# Altium schematic sheet top_level.SchDoc
size A4
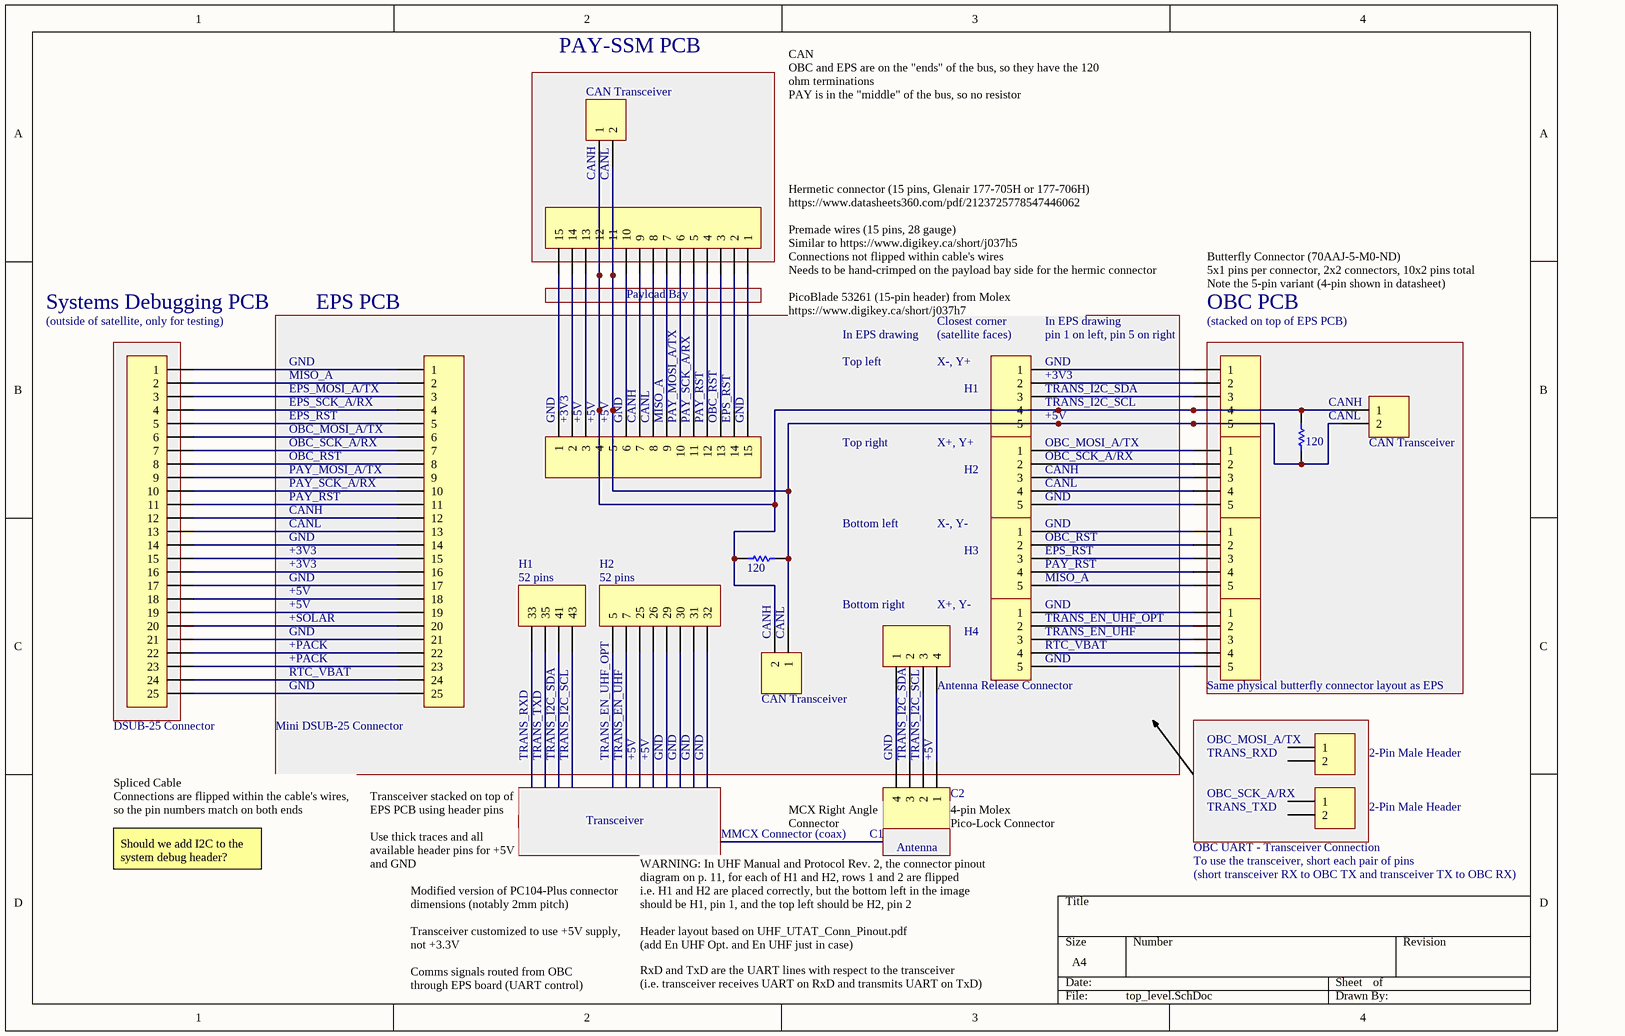
[diagram p0: top_level.SchDoc]

## Parts
(Parts that share a designator on the sheet are numbered #1, #2 ... from top to bottom, then left to right.)
C2  Antenna Release Connector  [HDR1X4]  (value not drawn)
P?#1  CAN Transceiver  [HDR1X2]
P?#2  Header 15  [HDR1X15]  (value not drawn)
P?#3  Header 25  [HDR1X25]  (value not drawn)
P?#4  Header 25  [HDR1X25]  (value not drawn)
P?#5  Header 5  [HDR1X5]  (value not drawn)
P?#6  Header 5  [HDR1X5]  (value not drawn)
P?#7  CAN Transceiver  [HDR1X2]
P?#8  Header 15  [HDR1X15]  (value not drawn)
P?#9  Header 5  [HDR1X5]  (value not drawn)
P?#10  Header 5  [HDR1X5]  (value not drawn)
P?#11  Header 5  [HDR1X5]  (value not drawn)
P?#12  Header 5  [HDR1X5]  (value not drawn)
P?#13  Header 5  [HDR1X5]  (value not drawn)
P?#14  Header 5  [HDR1X5]  (value not drawn)
P?#15  Header 4  [HDR1X4]  (value not drawn)
P?#16  Header 8  [HDR1X8]  (value not drawn)
P?#17  CAN Transceiver  [HDR1X2]
P?#18  Antenna Release Connector  [HDR1X4]  (value not drawn)
P?#19  Header 2  [HDR1X2]  (value not drawn)
P?#20  Header 2  [HDR1X2]  (value not drawn)
R?#1  value 120  [AXIAL-0.3]  (hidden comment: Res1)
R?#2  value 120  [AXIAL-0.3]  (hidden comment: Res1)

## Blocks framed on the sheet
PAY-SSM PCB: P?#1 P?#2
EPS PCB: P?#4 P?#5 P?#8 P?#9 P?#11 P?#13 P?#15-P?#18 R?#2

## Nets
NetC2_1: C2.1 P?#18.4
NetC2_2: C2.2 P?#18.3
NetC2_3: C2.3 P?#18.2
NetC2_4: C2.4 P?#18.1
NetP?#1_1: P?#1.1 P?#2.12 P?#5.4 P?#6.4 P?#7.1 P?#8.4 P?#17.2 R?#1.2 R?#2.2
NetP?#1_2: P?#1.2 P?#2.11 P?#5.5 P?#6.5 P?#7.2 P?#8.5 P?#17.1 R?#1.1 R?#2.1
NetP?#2_1: P?#2.1 P?#8.15
NetP?#2_2: P?#2.2 P?#8.14
NetP?#2_3: P?#2.3 P?#8.13
NetP?#2_4: P?#2.4 P?#8.12
NetP?#2_5: P?#2.5 P?#8.11
NetP?#2_6: P?#2.6 P?#8.10
NetP?#2_7: P?#2.7 P?#8.9
NetP?#2_8: P?#2.8 P?#8.8
NetP?#2_9: P?#2.9 P?#8.7
NetP?#2_10: P?#2.10 P?#8.6
NetP?#2_13: P?#2.13 P?#8.3
NetP?#2_14: P?#2.14 P?#8.2
NetP?#2_15: P?#2.15 P?#8.1
NetP?#3_1: P?#3.1 P?#4.1
NetP?#3_2: P?#3.2 P?#4.2
NetP?#3_3: P?#3.3 P?#4.3
NetP?#3_4: P?#3.4 P?#4.4
NetP?#3_5: P?#3.5 P?#4.5
NetP?#3_6: P?#3.6 P?#4.6
NetP?#3_7: P?#3.7 P?#4.7
NetP?#3_8: P?#3.8 P?#4.8
NetP?#3_9: P?#3.9 P?#4.9
NetP?#3_10: P?#3.10 P?#4.10
NetP?#3_11: P?#3.11 P?#4.11
NetP?#3_12: P?#3.12 P?#4.12
NetP?#3_13: P?#3.13 P?#4.13
NetP?#3_14: P?#3.14 P?#4.14
NetP?#3_15: P?#3.15 P?#4.15
NetP?#3_16: P?#3.16 P?#4.16
NetP?#3_17: P?#3.17 P?#4.17
NetP?#3_18: P?#3.18 P?#4.18
NetP?#3_19: P?#3.19 P?#4.19
NetP?#3_20: P?#3.20 P?#4.20
NetP?#3_21: P?#3.21 P?#4.21
NetP?#3_22: P?#3.22 P?#4.22
NetP?#3_23: P?#3.23 P?#4.23
NetP?#3_24: P?#3.24 P?#4.24
NetP?#3_25: P?#3.25 P?#4.25
NetP?#5_1: P?#5.1 P?#6.1
NetP?#5_2: P?#5.2 P?#6.2
NetP?#5_3: P?#5.3 P?#6.3
NetP?#9_1: P?#9.1 P?#10.1
NetP?#9_2: P?#9.2 P?#10.2
NetP?#9_3: P?#9.3 P?#10.3
NetP?#9_4: P?#9.4 P?#10.4
NetP?#9_5: P?#9.5 P?#10.5
NetP?#11_1: P?#11.1 P?#12.1
NetP?#11_2: P?#11.2 P?#12.2
NetP?#11_3: P?#11.3 P?#12.3
NetP?#11_4: P?#11.4 P?#12.4
NetP?#11_5: P?#11.5 P?#12.5
NetP?#13_1: P?#13.1 P?#14.1
NetP?#13_2: P?#13.2 P?#14.2
NetP?#13_3: P?#13.3 P?#14.3
NetP?#13_4: P?#13.4 P?#14.4
NetP?#13_5: P?#13.5 P?#14.5

Not connected (* = marked no-connect by the designer): P?#15 1(33) 2(35) 3(41) 4(43); P?#16 1(5) 2(7) 3(25) 4(26) 5(29) 6(30) 7(31) 8(32); P?#19 1 2; P?#20 1 2

## Notes on the sheet
- CAN
  OBC and EPS are on the "ends" of the bus, so they have the 120 ohm terminations
  PAY is in the "middle" of the bus, so no resistor
- (near P?#1) CANH
- (near P?#1) CANL
- Hermetic connector (15 pins, Glenair 177-705H or 177-706H)
  https://www.datasheets360.com/pdf/2123725778547446062
- Systems Debugging PCB
- (near P?#2) Payload Bay
- PicoBlade 53261 (15-pin header) from Molex
  https://www.digikey.ca/short/j037h7
- (near P?#2) Premade wires (15 pins, 28 gauge)
  Similar to https://www.digikey.ca/short/j037h5
  Connections not flipped within cable's wires
  Needs to be hand-crimped on the payload bay side for the hermic connector
- OBC PCB
- Butterfly Connector (70AAJ-5-M0-ND)
  5x1 pins per connector, 2x2 connectors, 10x2 pins total
  Note the 5-pin variant (4-pin shown in datasheet)
- (near P?#3) (outside of satellite, only for testing)
- GND
- MISO_A
- In EPS drawing
- Top left
- X-, Y+
- (near P?#5) Closest corner
- (near P?#5) (satellite faces)
- (near P?#5) +3V3
- (near P?#5) GND
- (near P?#5) In EPS drawing
- (near P?#6) pin 1 on left, pin 5 on right
- (near P?#6) (stacked on top of EPS PCB)
- EPS_MOSI_A/TX
- EPS_SCK_A/RX
- EPS_RST
- OBC_MOSI_A/TX
- OBC_SCK_A/RX
- (near P?#8) GND
- (near P?#8) +3V3
- (near P?#8) +5V
- (near P?#8) CANH
- (near P?#8) CANL
- (near P?#8) MISO_A
- (near P?#8) PAY_MOSI_A/TX
- (near P?#8) PAY_SCK_A/RX
- (near P?#8) PAY_RST
- (near P?#8) OBC_RST
- (near P?#8) EPS_RST
- Top right
- X+, Y+
- H1
- (near P?#9) OBC_MOSI_A/TX
- (near P?#5) +5V
- (near P?#5) TRANS_I2C_SDA
- (near P?#5) TRANS_I2C_SCL
- (near P?#7) CANH
- CANL
- OBC_RST
- PAY_MOSI_A/TX
- PAY_SCK_A/RX
- PAY_RST
- CANH
- H2
- (near P?#9) CANH
- (near P?#9) CANL
- (near P?#9) OBC_SCK_A/RX
- (near P?#9) GND
- +3V3
- (near P?#15) 52 pins
- (near P?#16) 52 pins
- Bottom left
- X-, Y-
- H3
- (near P?#11) EPS_RST
- (near P?#11) PAY_RST
- (near P?#11) OBC_RST
- (near P?#11) MISO_A
- (near P?#11) GND
- +PACK
- +5V
- +SOLAR
- (near P?#17) CANH
- (near P?#17) CANL
- Bottom right
- X+, Y-
- (near P?#18) H4
- (near P?#13) TRANS_EN_UHF_OPT
- (near P?#13) TRANS_EN_UHF
- (near P?#13) RTC_VBAT
- (near P?#13) GND
- RTC_VBAT
- (near P?#13) Antenna Release Connector
- (near P?#14) Same physical butterfly connector layout as EPS
- (near P?#3) DSUB-25 Connector
- (near P?#4) Mini DSUB-25 Connector
- TRANS_RXD
- TRANS_TXD
- TRANS_I2C_SDA
- TRANS_I2C_SCL
- (near P?#16) TRANS_EN_UHF_OPT
- TRANS_EN_UHF
- (near C2) GND
- (near C2) +5V
- (near P?#19) TRANS_RXD
- (near P?#19) OBC_MOSI_A/TX
- 2-Pin Male Header
- Spliced Cable
  Connections are flipped within the cable's wires,
  so the pin numbers match on both ends
- Transceiver stacked on top of EPS PCB using header pins
- Transceiver
- MMCX Connector (coax)
- (near C2) MCX Right Angle Connector
- (near C2) C1
- Antenna
- (near C2) 4-pin Molex Pico-Lock Connector
- (near P?#20) OBC UART - Transceiver Connection
- (near P?#20) TRANS_TXD
- (near P?#20) OBC_SCK_A/RX
- Should we add I2C to the system debug header?
- Use thick traces and all available header pins for +5V and GND
- Modified version of PC104-Plus connector dimensions (notably 2mm pitch)
- WARNING: In UHF Manual and Protocol Rev. 2, the connector pinout diagram on p. 11, for each of H1 and H2, rows 1 and 2 are flipped
  i.e. H1 and H2 are placed correctly, but the bottom left in the image should be H1, pin 1, and the top left should be H2, pin 2
- (near P?#20) To use the transceiver, short each pair of pins
- (short transceiver RX to OBC TX and transceiver TX to OBC RX)
- Comms signals routed from OBC through EPS board (UART control)
- Transceiver customized to use +5V supply, not +3.3V
  To get 2W of power
  (add En UHF Opt. and En UHF just in case)
- Header layout based on UHF_UTAT_Conn_Pinout.pdf
  (add En UHF Opt. and En UHF just in case)
- RxD and TxD are the UART lines with respect to the transceiver
  (i.e. transceiver receives UART on RxD and transmits UART on TxD)

## Library data of the parts
C2 P?#15 P?#18 = Header 4: Header, 4-Pin; LatestRevisionDate: 17-Jul-2002; LatestRevisionNote: Re-released for DXP Platform.; Publisher: Altium Limited
P?#1 P?#7 P?#17 P?#19 P?#20 = Header 2: Header, 2-Pin; LatestRevisionDate: 17-Jul-2002; LatestRevisionNote: Re-released for DXP Platform.; Publisher: Altium Limited
P?#2 P?#8 = Header 15: Header, 15-Pin; LatestRevisionDate: 17-Jul-2002; LatestRevisionNote: Re-released for DXP Platform.; Publisher: Altium Limited
P?#3 P?#4 = Header 25: Header, 25-Pin; LatestRevisionDate: 17-Jul-2002; LatestRevisionNote: Re-released for DXP Platform.; Publisher: Altium Limited
P?#5 P?#6 P?#9-P?#14 = Header 5: Header, 5-Pin; LatestRevisionDate: 17-Jul-2002; LatestRevisionNote: Re-released for DXP Platform.; Publisher: Altium Limited
P?#16 = Header 8: Header, 8-Pin; LatestRevisionDate: 17-Jul-2002; LatestRevisionNote: Re-released for DXP Platform.; Publisher: Altium Limited
R?#1 R?#2 = Res1: Resistor; Published: 8-Jun-2000; LatestRevisionDate: 17-Jul-2002; LatestRevisionNote: Re-released for DXP Platform.; PackageReference: AXIAL-0.3; Publisher: Altium Limited; PackageDescription: Axial Device, Thru-Hole; 2 Leads; 0.3 in Pin Spacing